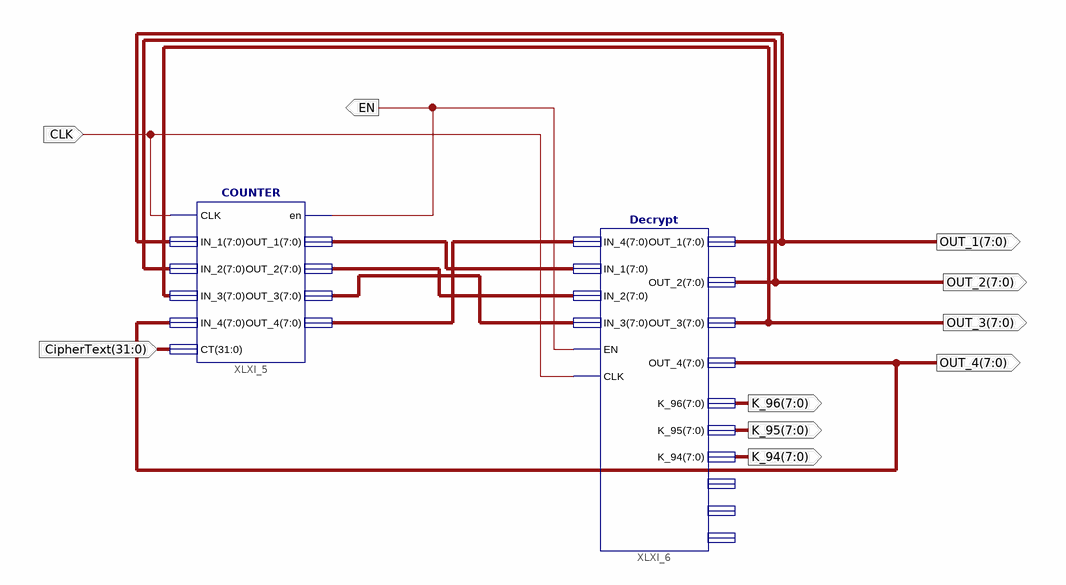
[diagram p0: schematic sheet 1]
// Xilinx ISE schematic Decrypt_main.sch (spartan3e) as structural Verilog: 2 symbols, 10 ports
module Decrypt_main (
  input  CLK,
  input  [31:0] CipherText,
  output [7:0] OUT_1,
  output [7:0] OUT_2,
  output [7:0] OUT_3,
  output [7:0] OUT_4,
  output EN,
  output [7:0] K_94,
  output [7:0] K_95,
  output [7:0] K_96
);

  wire [7:0] XLXN_21, XLXN_22, XLXN_23, XLXN_24;

  COUNTER XLXI_5 (
    .CLK(CLK), .IN_1(OUT_1), .IN_2(OUT_2), .IN_3(OUT_3), .IN_4(OUT_4), .en(EN), .OUT_1(XLXN_22),
    .OUT_2(XLXN_23), .OUT_3(XLXN_24), .OUT_4(XLXN_21), .CT(CipherText));
  Decrypt XLXI_6 (
    .IN_4(XLXN_21), .IN_1(XLXN_22), .IN_2(XLXN_23), .IN_3(XLXN_24), .EN(EN), .CLK(CLK), .OUT_1(OUT_1),
    .OUT_2(OUT_2), .OUT_3(OUT_3), .OUT_4(OUT_4), .K_96(K_96), .K_95(K_95), .K_94(K_94));  // open: S_BOX_OUT, First_XOR, Final_XOR
endmodule
